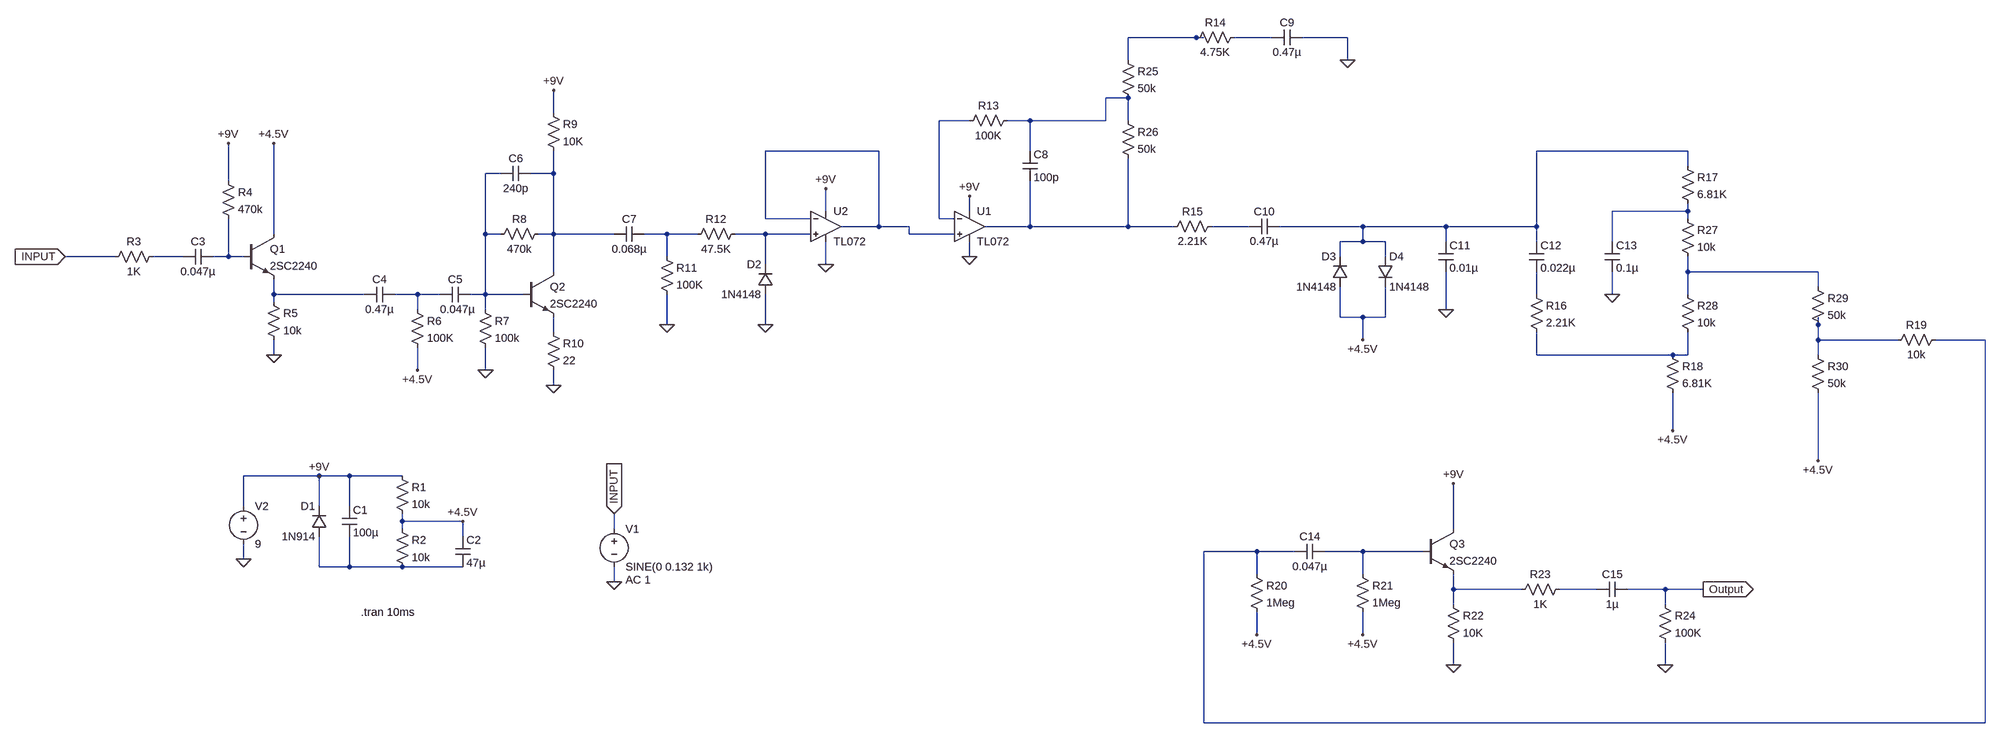
[diagram p0: schematic Distortion.asc]
Distortion.asc, the LTspice schematic file:
Version 4
SHEET 1 3424 1364
WIRE 944 -144 800 -144
WIRE 960 -144 944 -144
WIRE 1104 -144 1024 -144
WIRE 1264 -144 1168 -144
WIRE 800 -96 800 -144
WIRE 1264 -96 1264 -144
WIRE 800 -16 752 -16
WIRE -416 16 -416 -32
WIRE 464 32 400 32
WIRE 592 32 544 32
WIRE 752 32 752 -16
WIRE 752 32 592 32
WIRE 800 32 800 -16
WIRE 272 96 32 96
WIRE 592 96 592 32
WIRE 1984 96 1664 96
WIRE 1984 128 1984 96
WIRE -528 144 -560 144
WIRE -416 144 -416 96
WIRE -416 144 -464 144
WIRE -1104 160 -1104 80
WIRE 160 224 160 176
WIRE 464 224 464 192
WIRE 1984 224 1984 208
WIRE 1984 224 1824 224
WIRE 32 240 32 96
WIRE 128 240 32 240
WIRE 400 240 400 32
WIRE 432 240 400 240
WIRE 1984 240 1984 224
WIRE 272 256 272 96
WIRE 272 256 192 256
WIRE 336 256 272 256
WIRE 592 256 592 160
WIRE 592 256 496 256
WIRE 800 256 800 112
WIRE 800 256 592 256
WIRE 896 256 800 256
WIRE 1056 256 976 256
WIRE 1296 256 1120 256
WIRE 1472 256 1296 256
WIRE 1664 256 1664 96
WIRE 1664 256 1472 256
WIRE -1008 272 -1008 80
WIRE -560 272 -560 144
WIRE -528 272 -560 272
WIRE -416 272 -416 144
WIRE -416 272 -448 272
WIRE -288 272 -416 272
WIRE -176 272 -224 272
WIRE -112 272 -176 272
WIRE 32 272 -32 272
WIRE 128 272 32 272
WIRE 336 272 336 256
WIRE 432 272 336 272
WIRE 1296 288 1296 256
WIRE 1296 288 1248 288
WIRE 1344 288 1296 288
WIRE 1472 288 1472 256
WIRE 1664 288 1664 256
WIRE 1824 288 1824 224
WIRE -1344 320 -1456 320
WIRE -1200 320 -1264 320
WIRE -1104 320 -1104 240
WIRE -1104 320 -1136 320
WIRE -1072 320 -1104 320
WIRE -176 320 -176 272
WIRE 464 320 464 288
WIRE 1248 320 1248 288
WIRE 1344 320 1344 288
WIRE 32 336 32 272
WIRE 160 336 160 288
WIRE -416 352 -416 272
WIRE 1984 352 1984 320
WIRE 2416 352 1984 352
WIRE 2416 384 2416 352
WIRE -1008 400 -1008 368
WIRE -816 400 -1008 400
WIRE -704 400 -752 400
WIRE -656 400 -704 400
WIRE -560 400 -560 272
WIRE -560 400 -592 400
WIRE -480 400 -560 400
WIRE 1664 400 1664 352
WIRE 1824 400 1824 352
WIRE 1984 400 1984 352
WIRE -1008 416 -1008 400
WIRE -704 432 -704 400
WIRE -560 432 -560 400
WIRE 1472 432 1472 352
WIRE 1248 448 1248 384
WIRE 1296 448 1248 448
WIRE 1344 448 1344 384
WIRE 1344 448 1296 448
WIRE -176 464 -176 400
WIRE 32 464 32 400
WIRE 2416 464 2416 448
WIRE -416 480 -416 448
WIRE 1296 496 1296 448
WIRE 2416 496 2416 464
WIRE 2736 496 2416 496
WIRE 2928 496 2816 496
WIRE -1008 528 -1008 496
WIRE 1664 528 1664 480
WIRE 1952 528 1664 528
WIRE 1984 528 1984 480
WIRE 1984 528 1952 528
WIRE 2416 528 2416 496
WIRE -704 560 -704 512
WIRE -560 560 -560 512
WIRE -416 592 -416 560
WIRE 1952 688 1952 608
WIRE 2416 752 2416 608
WIRE -912 784 -1072 784
WIRE -848 784 -912 784
WIRE -736 784 -848 784
WIRE -1072 848 -1072 784
WIRE -912 848 -912 784
WIRE -848 848 -848 784
WIRE -736 880 -736 864
WIRE -608 880 -736 880
WIRE -736 896 -736 880
WIRE -288 896 -288 864
WIRE 1488 896 1488 800
WIRE -608 912 -608 880
WIRE 1072 944 960 944
WIRE 1152 944 1072 944
WIRE 1296 944 1216 944
WIRE 1424 944 1296 944
WIRE -1072 960 -1072 928
WIRE -912 976 -912 912
WIRE -848 976 -848 912
WIRE -848 976 -912 976
WIRE -736 976 -848 976
WIRE -608 976 -736 976
WIRE 1072 992 1072 944
WIRE 1296 992 1296 944
WIRE -288 1008 -288 976
WIRE 1488 1024 1488 992
WIRE 1632 1024 1488 1024
WIRE 1792 1024 1712 1024
WIRE 1936 1024 1856 1024
WIRE 2016 1024 1936 1024
WIRE 1488 1056 1488 1024
WIRE 1936 1056 1936 1024
WIRE 1072 1120 1072 1072
WIRE 1296 1120 1296 1072
WIRE 1488 1184 1488 1136
WIRE 1936 1184 1936 1136
WIRE 960 1360 960 944
WIRE 2928 1360 2928 496
WIRE 2928 1360 960 1360
FLAG -912 784 +9V
FLAG -608 880 +4.5V
FLAG -1008 528 0
FLAG -1104 80 +9V
FLAG -1008 80 +4.5V
FLAG -1456 320 INPUT
IOPIN -1456 320 In
FLAG -560 560 0
FLAG -416 592 0
FLAG -416 -32 +9V
FLAG -176 464 0
FLAG 32 464 0
FLAG 1264 -96 0
FLAG 1472 432 0
FLAG 1296 496 +4.5V
FLAG 1824 400 0
FLAG 1952 688 +4.5V
FLAG 2416 752 +4.5V
FLAG 1072 1120 +4.5V
FLAG 1296 1120 +4.5V
FLAG 1488 800 +9V
FLAG 1936 1184 0
FLAG 2016 1024 Output
IOPIN 2016 1024 Out
FLAG 1488 1184 0
FLAG -288 1008 0
FLAG -288 864 INPUT
IOPIN -288 864 In
FLAG -1072 960 0
FLAG 464 320 0
FLAG 464 192 +9V
FLAG 160 336 0
FLAG 160 176 +9V
FLAG -704 560 +4.5V
SYMBOL diode -896 912 R180
WINDOW 0 24 64 Left 2
WINDOW 3 24 0 Left 2
SYMATTR InstName D1
SYMATTR Value 1N914
SYMBOL cap -864 848 R0
SYMATTR InstName C1
SYMATTR Value 100µ
SYMATTR SpiceLine V=6.3 Irms=0 Rser=0 Lser=0 mfg="Murata" pn="GRM21BR60J107ME15" type="X5R"
SYMBOL res -752 768 R0
SYMATTR InstName R1
SYMATTR Value 10k
SYMBOL res -752 880 R0
SYMATTR InstName R2
SYMATTR Value 10k
SYMBOL cap -624 912 R0
SYMATTR InstName C2
SYMATTR Value 47µ
SYMATTR SpiceLine V=2.5 Irms=0 Rser=0 Lser=0 mfg="Murata" pn="GRM188R60E476ME15" type="X5R"
SYMBOL res -1248 304 R90
WINDOW 0 0 56 VBottom 2
WINDOW 3 32 56 VTop 2
SYMATTR InstName R3
SYMATTR Value 1K
SYMATTR SpiceLine tol=1 pwr=0.1
SYMBOL cap -1136 304 R90
WINDOW 0 0 32 VBottom 2
WINDOW 3 32 32 VTop 2
SYMATTR InstName C3
SYMATTR Value 0.047µ
SYMATTR SpiceLine V=4 Irms=760m Rser=0.0732706 Lser=0 mfg="KEMET" pn="C0402C473K7PAC" type="X5R"
SYMBOL res -1120 144 R0
SYMATTR InstName R4
SYMATTR Value 470k
SYMBOL res -1024 400 R0
SYMATTR InstName R5
SYMATTR Value 10k
SYMBOL npn -1072 272 R0
SYMATTR InstName Q1
SYMATTR Value 2SC2240
SYMBOL cap -752 384 R90
WINDOW 0 0 32 VBottom 2
WINDOW 3 32 32 VTop 2
SYMATTR InstName C4
SYMATTR Value 0.47µ
SYMATTR SpiceLine V=4 Irms=3.38 Rser=0.0190129 Lser=0 mfg="KEMET" pn="C0805C474K7PAC" type="X5R"
SYMBOL cap -592 384 R90
WINDOW 0 0 32 VBottom 2
WINDOW 3 32 27 VTop 2
SYMATTR InstName C5
SYMATTR Value 0.047µ
SYMATTR SpiceLine V=4 Irms=760m Rser=0.0732706 Lser=0 mfg="KEMET" pn="C0402C473K7PAC" type="X5R"
SYMBOL res -720 416 R0
SYMATTR InstName R6
SYMATTR Value 100K
SYMATTR SpiceLine tol=1 pwr=0.1
SYMBOL npn -480 352 R0
SYMATTR InstName Q2
SYMATTR Value 2SC2240
SYMBOL res -576 416 R0
SYMATTR InstName R7
SYMATTR Value 100k
SYMBOL res -432 256 R90
WINDOW 0 0 56 VBottom 2
WINDOW 3 32 56 VTop 2
SYMATTR InstName R8
SYMATTR Value 470k
SYMBOL cap -464 128 R90
WINDOW 0 0 32 VBottom 2
WINDOW 3 32 32 VTop 2
SYMATTR InstName C6
SYMATTR Value 240p
SYMATTR SpiceLine V=50 Irms=0 Rser=0 Lser=0 mfg="Murata" pn="GCM1555C1H241JA16" type="C0G"
SYMBOL res -432 0 R0
SYMATTR InstName R9
SYMATTR Value 10K
SYMATTR SpiceLine tol=1 pwr=0.1
SYMBOL res -432 464 R0
SYMATTR InstName R10
SYMATTR Value 22
SYMBOL cap -224 256 R90
WINDOW 0 0 32 VBottom 2
WINDOW 3 32 32 VTop 2
SYMATTR InstName C7
SYMATTR Value 0.068µ
SYMATTR SpiceLine V=4 Irms=1.1 Rser=0.0536347 Lser=0 mfg="KEMET" pn="C0402C683K7PAC" type="X5R"
SYMBOL res -192 304 R0
SYMATTR InstName R11
SYMATTR Value 100K
SYMATTR SpiceLine tol=1 pwr=0.1
SYMBOL res -16 256 R90
WINDOW 0 0 56 VBottom 2
WINDOW 3 32 56 VTop 2
SYMATTR InstName R12
SYMATTR Value 47.5K
SYMATTR SpiceLine tol=1 pwr=0.1
SYMBOL diode 48 400 R180
WINDOW 0 24 64 Left 2
WINDOW 3 24 0 Left 2
SYMATTR InstName D2
SYMATTR Value 1N4148
SYMBOL cap 576 96 R0
SYMATTR InstName C8
SYMATTR Value 100p
SYMATTR SpiceLine V=10 Irms=0 Rser=0.8826 Lser=319p mfg="Würth Elektronik" pn="885012207004 WCAP-CSGP 0805" type="X7R"
SYMBOL res 560 16 R90
WINDOW 0 0 56 VBottom 2
WINDOW 3 32 56 VTop 2
SYMATTR InstName R13
SYMATTR Value 100K
SYMATTR SpiceLine tol=1 pwr=0.1
SYMBOL res 1040 -160 R90
WINDOW 0 0 56 VBottom 2
WINDOW 3 32 56 VTop 2
SYMATTR InstName R14
SYMATTR Value 4.75K
SYMATTR SpiceLine tol=1 pwr=0.1
SYMBOL cap 1168 -160 R90
WINDOW 0 0 32 VBottom 2
WINDOW 3 32 32 VTop 2
SYMATTR InstName C9
SYMATTR Value 0.47µ
SYMATTR SpiceLine V=4 Irms=3.38 Rser=0.0190129 Lser=0 mfg="KEMET" pn="C0805C474K7PAC" type="X5R"
SYMBOL res 992 240 R90
WINDOW 0 0 56 VBottom 2
WINDOW 3 32 56 VTop 2
SYMATTR InstName R15
SYMATTR Value 2.21K
SYMATTR SpiceLine tol=1 pwr=0.1
SYMBOL cap 1120 240 R90
WINDOW 0 0 32 VBottom 2
WINDOW 3 32 32 VTop 2
SYMATTR InstName C10
SYMATTR Value 0.47µ
SYMATTR SpiceLine V=4 Irms=3.38 Rser=0.0190129 Lser=0 mfg="KEMET" pn="C0805C474K7PAC" type="X5R"
SYMBOL diode 1264 384 R180
WINDOW 0 24 64 Left 2
WINDOW 3 24 0 Left 2
SYMATTR InstName D3
SYMATTR Value 1N4148
SYMBOL diode 1328 320 R0
SYMATTR InstName D4
SYMATTR Value 1N4148
SYMBOL cap 1456 288 R0
SYMATTR InstName C11
SYMATTR Value 0.01µ
SYMATTR SpiceLine V=4 Irms=162m Rser=0.395426 Lser=0 mfg="KEMET" pn="C0402C103K7PAC" type="X5R"
SYMBOL cap 1648 288 R0
SYMATTR InstName C12
SYMATTR Value 0.022µ
SYMATTR SpiceLine V=4 Irms=356m Rser=0.150334 Lser=0 mfg="KEMET" pn="C0402C223K7PAC" type="X5R"
SYMBOL res 1648 384 R0
SYMATTR InstName R16
SYMATTR Value 2.21K
SYMATTR SpiceLine tol=1 pwr=0.1
SYMBOL res 1968 112 R0
SYMATTR InstName R17
SYMATTR Value 6.81K
SYMATTR SpiceLine tol=1 pwr=0.1
SYMBOL cap 1808 288 R0
SYMATTR InstName C13
SYMATTR Value 0.1µ
SYMATTR SpiceLine V=4 Irms=0 Rser=0 Lser=0 mfg="Murata" pn="GRM022R60G153KE15" type="X5R"
SYMBOL res 1936 512 R0
SYMATTR InstName R18
SYMATTR Value 6.81K
SYMATTR SpiceLine tol=1 pwr=0.1
SYMBOL res 2832 480 R90
WINDOW 0 0 56 VBottom 2
WINDOW 3 32 56 VTop 2
SYMATTR InstName R19
SYMATTR Value 10k
SYMBOL res 1056 976 R0
SYMATTR InstName R20
SYMATTR Value 1Meg
SYMATTR SpiceLine tol=1 pwr=0.1
SYMBOL cap 1216 928 R90
WINDOW 0 0 32 VBottom 2
WINDOW 3 32 32 VTop 2
SYMATTR InstName C14
SYMATTR Value 0.047µ
SYMATTR SpiceLine V=4 Irms=760m Rser=0.0732706 Lser=0 mfg="KEMET" pn="C0402C473K7PAC" type="X5R"
SYMBOL res 1280 976 R0
SYMATTR InstName R21
SYMATTR Value 1Meg
SYMATTR SpiceLine tol=1 pwr=0.1
SYMBOL npn 1424 896 R0
SYMATTR InstName Q3
SYMATTR Value 2SC2240
SYMBOL res 1472 1040 R0
SYMATTR InstName R22
SYMATTR Value 10K
SYMATTR SpiceLine tol=1 pwr=0.1
SYMBOL res 1728 1008 R90
WINDOW 0 0 56 VBottom 2
WINDOW 3 32 56 VTop 2
SYMATTR InstName R23
SYMATTR Value 1K
SYMATTR SpiceLine tol=1 pwr=0.1
SYMBOL cap 1856 1008 R90
WINDOW 0 0 32 VBottom 2
WINDOW 3 32 32 VTop 2
SYMATTR InstName C15
SYMATTR Value 1µ
SYMATTR SpiceLine V=4 Irms=0 Rser=0 Lser=0 mfg="Murata" pn="GRM032R60G105ME05" type="X5R"
SYMBOL res 1920 1040 R0
SYMATTR InstName R24
SYMATTR Value 100K
SYMATTR SpiceLine tol=1 pwr=0.1
SYMBOL voltage -288 880 R0
WINDOW 123 24 124 Left 2
WINDOW 39 0 0 Left 0
SYMATTR Value2 AC 1
SYMATTR InstName V1
SYMATTR Value SINE(0 0.132 1k)
SYMBOL voltage -1072 832 R0
WINDOW 123 0 0 Left 0
WINDOW 39 0 0 Left 0
SYMATTR InstName V2
SYMATTR Value 9
SYMBOL TL072 464 256 R0
SYMATTR InstName U1
SYMBOL TL072 160 256 R0
SYMATTR InstName U2
SYMBOL res 784 -112 R0
SYMATTR InstName R25
SYMATTR Value 50k
SYMBOL res 784 16 R0
SYMATTR InstName R26
SYMATTR Value 50k
SYMBOL res 1968 224 R0
SYMATTR InstName R27
SYMATTR Value 10k
SYMBOL res 1968 384 R0
SYMATTR InstName R28
SYMATTR Value 10k
SYMBOL res 2400 368 R0
SYMATTR InstName R29
SYMATTR Value 50k
SYMBOL res 2400 512 R0
SYMATTR InstName R30
SYMATTR Value 50k
TEXT -824 1072 Left 2 !.tran 10ms

The netlist it stands for:
* Distortion.asc
D1 N025 +9V 1N914
C1 +9V N025 100µ V=6.3 Irms=0 Rser=0 Lser=0 mfg="Murata" pn="GRM21BR60J107ME15" type="X5R"
R1 +9V +4.5V 10k
R2 +4.5V N025 10k
C2 +4.5V N025 47µ V=2.5 Irms=0 Rser=0 Lser=0 mfg="Murata" pn="GRM188R60E476ME15" type="X5R"
R3 N014 INPUT 1K tol=1 pwr=0.1
C3 N015 N014 0.047µ V=4 Irms=760m Rser=0.0732706 Lser=0 mfg="KEMET" pn="C0402C473K7PAC" type="X5R"
R4 +9V N015 470k
R5 N017 0 10k
Q1 +4.5V N015 N017 0 2SC2240
C4 N018 N017 0.47µ V=4 Irms=3.38 Rser=0.0190129 Lser=0 mfg="KEMET" pn="C0805C474K7PAC" type="X5R"
C5 N007 N018 0.047µ V=4 Irms=760m Rser=0.0732706 Lser=0 mfg="KEMET" pn="C0402C473K7PAC" type="X5R"
R6 N018 +4.5V 100K tol=1 pwr=0.1
Q2 N008 N007 N021 0 2SC2240
R7 N007 0 100k
R8 N008 N007 470k
C6 N008 N007 240p V=50 Irms=0 Rser=0 Lser=0 mfg="Murata" pn="GCM1555C1H241JA16" type="C0G"
R9 +9V N008 10K tol=1 pwr=0.1
R10 N021 0 22
C7 N012 N008 0.068µ V=4 Irms=1.1 Rser=0.0536347 Lser=0 mfg="KEMET" pn="C0402C683K7PAC" type="X5R"
R11 N012 0 100K tol=1 pwr=0.1
R12 N013 N012 47.5K tol=1 pwr=0.1
D2 0 N013 1N4148
C8 N003 N010 100p V=10 Irms=0 Rser=0.8826 Lser=319p mfg="Würth Elektronik" pn="885012207004 WCAP-CSGP 0805" type="X7R"
R13 N003 N004 100K tol=1 pwr=0.1
R14 N002 N001 4.75K tol=1 pwr=0.1
C9 0 N002 0.47µ V=4 Irms=3.38 Rser=0.0190129 Lser=0 mfg="KEMET" pn="C0805C474K7PAC" type="X5R"
R15 N011 N010 2.21K tol=1 pwr=0.1
C10 N006 N011 0.47µ V=4 Irms=3.38 Rser=0.0190129 Lser=0 mfg="KEMET" pn="C0805C474K7PAC" type="X5R"
D3 +4.5V N006 1N4148
D4 N006 +4.5V 1N4148
C11 N006 0 0.01µ V=4 Irms=162m Rser=0.395426 Lser=0 mfg="KEMET" pn="C0402C103K7PAC" type="X5R"
C12 N006 N019 0.022µ V=4 Irms=356m Rser=0.150334 Lser=0 mfg="KEMET" pn="C0402C223K7PAC" type="X5R"
R16 N019 N023 2.21K tol=1 pwr=0.1
R17 N006 N009 6.81K tol=1 pwr=0.1
C13 N009 0 0.1µ V=4 Irms=0 Rser=0 Lser=0 mfg="Murata" pn="GRM022R60G153KE15" type="X5R"
R18 N023 +4.5V 6.81K tol=1 pwr=0.1
R19 N022 N020 10k
R20 N022 +4.5V 1Meg tol=1 pwr=0.1
C14 N024 N022 0.047µ V=4 Irms=760m Rser=0.0732706 Lser=0 mfg="KEMET" pn="C0402C473K7PAC" type="X5R"
R21 N024 +4.5V 1Meg tol=1 pwr=0.1
Q3 +9V N024 N026 0 2SC2240
R22 N026 0 10K tol=1 pwr=0.1
R23 N027 N026 1K tol=1 pwr=0.1
C15 Output N027 1µ V=4 Irms=0 Rser=0 Lser=0 mfg="Murata" pn="GRM032R60G105ME05" type="X5R"
R24 Output 0 100K tol=1 pwr=0.1
V1 INPUT 0 SINE(0 0.132 1k) AC 1
V2 +9V 0 9
* U1: TL072 (symbol TL072 not available, pins judged from their places): In+=N005 In-=N004 V+=+9V V-=0 OUT=N010
* U2: TL072 (symbol TL072 not available, pins judged from their places): In+=N013 In-=N005 V+=+9V V-=0 OUT=N005
R25 N001 N003 50k
R26 N003 N010 50k
R27 N009 N016 10k
R28 N016 N023 10k
R29 N016 N020 50k
R30 N020 +4.5V 50k
.model D D
.lib standard.dio
.model NPN NPN
.model PNP PNP
.lib standard.bjt
.tran 10ms
.backanno
.end